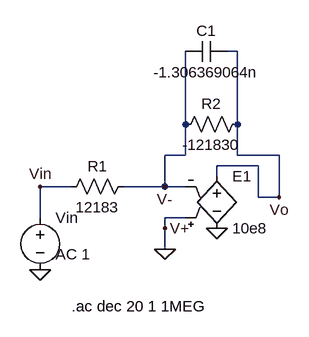
[diagram p0: schematic Spice1_3.asc]
Spice1_3.asc, the LTspice schematic file:
Version 4
SHEET 1 880 680
WIRE 352 -32 336 -32
WIRE 272 80 272 -32
WIRE 352 80 352 -32
WIRE 272 128 272 80
WIRE 272 128 240 128
WIRE 352 128 352 80
WIRE 416 128 352 128
WIRE 384 144 320 144
WIRE 320 160 320 144
WIRE 96 176 48 176
WIRE 240 176 240 128
WIRE 240 176 176 176
WIRE 272 176 240 176
WIRE 384 192 384 144
WIRE 416 192 416 128
WIRE 416 192 384 192
WIRE 48 224 48 176
WIRE 272 224 240 224
WIRE 240 240 240 224
WIRE 240 272 240 240
FLAG 48 304 0
FLAG 240 272 0
FLAG 240 240 V+
FLAG 240 176 V-
FLAG 416 192 Vo
FLAG 320 240 0
FLAG 48 176 Vin
SYMBOL res 192 160 R90
WINDOW 0 0 56 VBottom 2
WINDOW 3 32 56 VTop 2
SYMATTR InstName R1
SYMATTR Value 12183
SYMBOL res 368 64 R90
WINDOW 0 0 56 VBottom 2
WINDOW 3 32 56 VTop 2
SYMATTR InstName R2
SYMATTR Value -121830
SYMBOL cap 336 -48 R90
WINDOW 0 0 32 VBottom 2
WINDOW 3 32 32 VTop 2
SYMATTR InstName C1
SYMATTR Value -1.306369064n
SYMBOL voltage 48 208 R0
WINDOW 123 24 72 Left 2
WINDOW 39 0 0 Left 0
WINDOW 3 24 44 Left 0
SYMATTR Value2 AC 1
SYMATTR InstName Vin
SYMATTR Value ""
SYMBOL e2 320 144 R0
SYMATTR InstName E1
SYMATTR Value 10e8
TEXT 96 360 Left 2 !.ac dec 20 1 1MEG

The netlist it stands for:
* Spice1_3.asc
R1 V- Vin 12183
R2 Vo V- -121830
C1 Vo V- -1.306369064n
Vin Vin 0 AC 1
E1 Vo 0 0 V- 10e8
.ac dec 20 1 1MEG
.backanno
.end

* Results of the author's LTspice run, read from the files saved beside the schematic
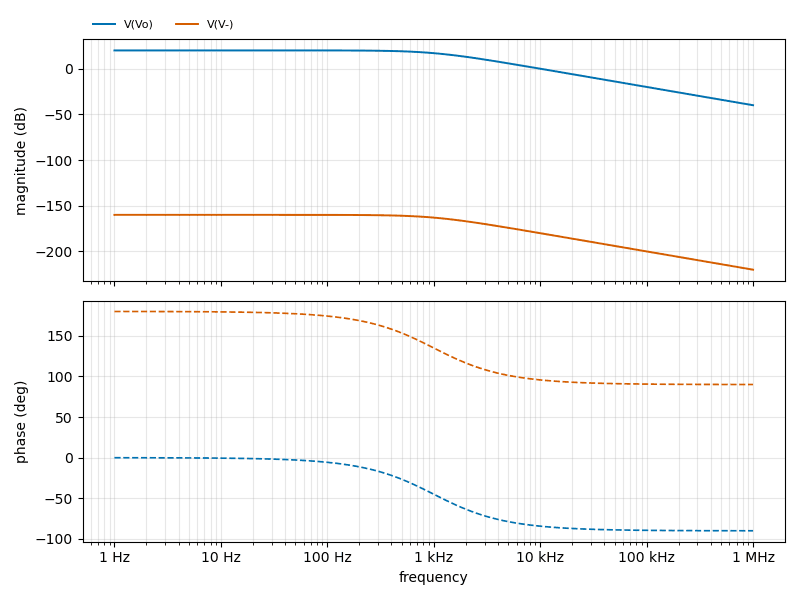
[diagram p1: AC Analysis of Spice1_3.asc, plotted from the saved traces]
* AC Analysis, 1 run:
*   V(Vo): 20.00 dB at 1 Hz, -40.00 dB at 1 MHz, peak 20.00 dB at 1 Hz, 3 dB below the peak at 1 kHz
*   V(V-): -160.00 dB at 1 Hz, -220.00 dB at 1 MHz, peak -160.00 dB at 1 Hz, 3 dB below the peak at 1 kHz